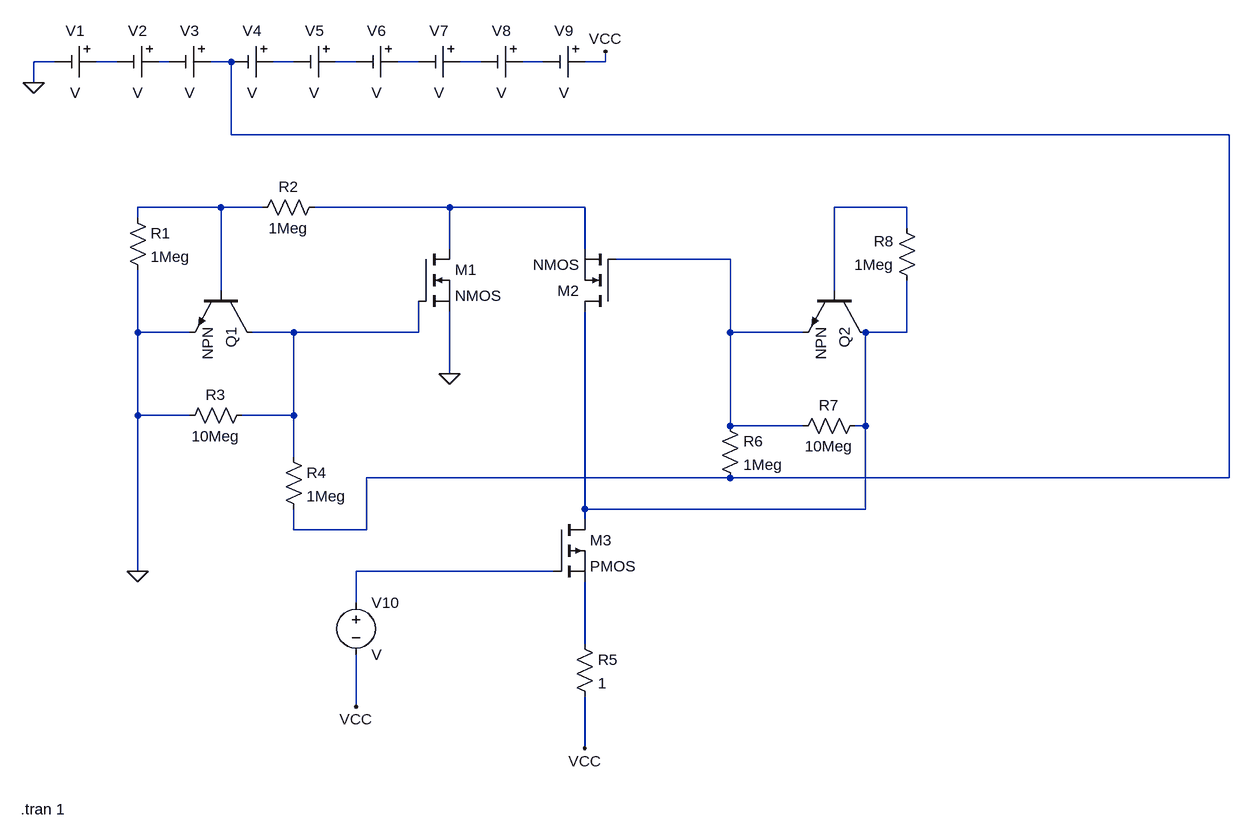
[diagram p0: schematic Gate.asc]
Gate.asc, the LTspice schematic file:
Version 4
SHEET 1 1812 1280
WIRE 0 112 -32 112
WIRE 96 112 64 112
WIRE 176 112 160 112
WIRE 272 112 240 112
WIRE 368 112 336 112
WIRE 464 112 432 112
WIRE 560 112 528 112
WIRE 656 112 624 112
WIRE 752 112 720 112
WIRE 848 112 848 96
WIRE 848 112 816 112
WIRE -32 144 -32 112
WIRE 272 224 272 112
WIRE 1808 224 272 224
WIRE 256 336 128 336
WIRE 320 336 256 336
WIRE 608 336 400 336
WIRE 816 336 608 336
WIRE 1312 336 1200 336
WIRE 128 352 128 336
WIRE 1312 368 1312 336
WIRE 608 400 608 336
WIRE 816 400 816 336
WIRE 1040 416 864 416
WIRE 256 464 256 336
WIRE 1200 464 1200 336
WIRE 128 528 128 432
WIRE 208 528 128 528
WIRE 368 528 304 528
WIRE 560 528 560 480
WIRE 560 528 368 528
WIRE 1040 528 1040 416
WIRE 1152 528 1040 528
WIRE 1312 528 1312 448
WIRE 1312 528 1248 528
WIRE 608 592 608 496
WIRE 128 656 128 528
WIRE 208 656 128 656
WIRE 368 656 368 528
WIRE 368 656 288 656
WIRE 1040 672 1040 528
WIRE 1152 672 1040 672
WIRE 1248 672 1248 528
WIRE 1248 672 1232 672
WIRE 368 720 368 656
WIRE 1040 752 480 752
WIRE 1808 752 1808 224
WIRE 1808 752 1040 752
WIRE 816 800 816 496
WIRE 1248 800 1248 672
WIRE 1248 800 816 800
WIRE 816 816 816 800
WIRE 368 832 368 800
WIRE 480 832 480 752
WIRE 480 832 368 832
WIRE 128 896 128 656
WIRE 768 896 464 896
WIRE 464 944 464 896
WIRE 816 1008 816 912
WIRE 464 1104 464 1024
WIRE 816 1168 816 1088
FLAG -32 144 0
FLAG 848 96 VCC
FLAG 128 896 0
FLAG 608 592 0
FLAG 464 1104 VCC
FLAG 816 1168 VCC
SYMBOL Misc\\cell 64 112 R90
WINDOW 0 -32 32 VBottom 2
WINDOW 3 32 32 VTop 2
SYMATTR InstName V1
SYMBOL Misc\\cell 160 112 R90
WINDOW 0 -32 32 VBottom 2
WINDOW 3 32 32 VTop 2
SYMATTR InstName V2
SYMBOL Misc\\cell 240 112 R90
WINDOW 0 -32 32 VBottom 2
WINDOW 3 32 32 VTop 2
SYMATTR InstName V3
SYMBOL Misc\\cell 336 112 R90
WINDOW 0 -32 32 VBottom 2
WINDOW 3 32 32 VTop 2
SYMATTR InstName V4
SYMBOL Misc\\cell 432 112 R90
WINDOW 0 -32 32 VBottom 2
WINDOW 3 32 32 VTop 2
SYMATTR InstName V5
SYMBOL Misc\\cell 528 112 R90
WINDOW 0 -32 32 VBottom 2
WINDOW 3 32 32 VTop 2
SYMATTR InstName V6
SYMBOL Misc\\cell 624 112 R90
WINDOW 0 -32 32 VBottom 2
WINDOW 3 32 32 VTop 2
SYMATTR InstName V7
SYMBOL Misc\\cell 720 112 R90
WINDOW 0 -32 32 VBottom 2
WINDOW 3 32 32 VTop 2
SYMATTR InstName V8
SYMBOL Misc\\cell 816 112 R90
WINDOW 0 -32 32 VBottom 2
WINDOW 3 32 32 VTop 2
SYMATTR InstName V9
SYMBOL res 112 336 R0
SYMATTR InstName R1
SYMATTR Value 1Meg
SYMBOL npn 304 464 R90
SYMATTR InstName Q1
SYMBOL res 416 320 R90
WINDOW 0 0 56 VBottom 2
WINDOW 3 32 56 VTop 2
SYMATTR InstName R2
SYMATTR Value 1Meg
SYMBOL res 304 640 R90
WINDOW 0 0 56 VBottom 2
WINDOW 3 32 56 VTop 2
SYMATTR InstName R3
SYMATTR Value 10Meg
SYMBOL nmos 560 400 R0
SYMATTR InstName M1
SYMBOL nmos 864 496 R180
SYMATTR InstName M2
SYMBOL res 352 704 R0
SYMATTR InstName R4
SYMATTR Value 1Meg
SYMBOL pmos 768 816 R0
SYMATTR InstName M3
SYMBOL res 800 992 R0
SYMATTR InstName R5
SYMATTR Value 1
SYMBOL voltage 464 928 R0
SYMATTR InstName V10
SYMBOL npn 1248 464 R90
SYMATTR InstName Q2
SYMBOL res 1024 656 R0
SYMATTR InstName R6
SYMATTR Value 1Meg
SYMBOL res 1248 656 R90
WINDOW 0 0 56 VBottom 2
WINDOW 3 32 56 VTop 2
SYMATTR InstName R7
SYMATTR Value 10Meg
SYMBOL res 1328 464 R180
WINDOW 0 36 76 Left 2
WINDOW 3 36 40 Left 2
SYMATTR InstName R8
SYMATTR Value 1Meg
TEXT -52 1262 Left 2 !.tran 1

The netlist it stands for:
* Gate.asc
V1 N001 0 V
V2 N002 N001 V
V3 N003 N002 V
V4 N004 N003 V
V5 N005 N004 V
V6 N006 N005 V
V7 N007 N006 V
V8 N008 N007 V
V9 VCC N008 V
R1 N009 0 1Meg
Q1 N013 N009 0 0 NPN
R2 N010 N009 1Meg
R3 N013 0 10Meg
M1 N010 N013 0 0 NMOS
M2 N014 N012 N010 N010 NMOS
R4 N013 N003 1Meg
M3 N014 N015 N016 N016 PMOS
R5 N016 VCC 1
V10 N015 VCC V
Q2 N014 N011 N012 0 NPN
R6 N012 N003 1Meg
R7 N014 N012 10Meg
R8 N014 N011 1Meg
.model NPN NPN
.model PNP PNP
.lib standard.bjt
.model NMOS NMOS
.model PMOS PMOS
.lib standard.mos
.tran 1
.backanno
.end